# EAGLE design untitled (EAGLE 7.2.0)
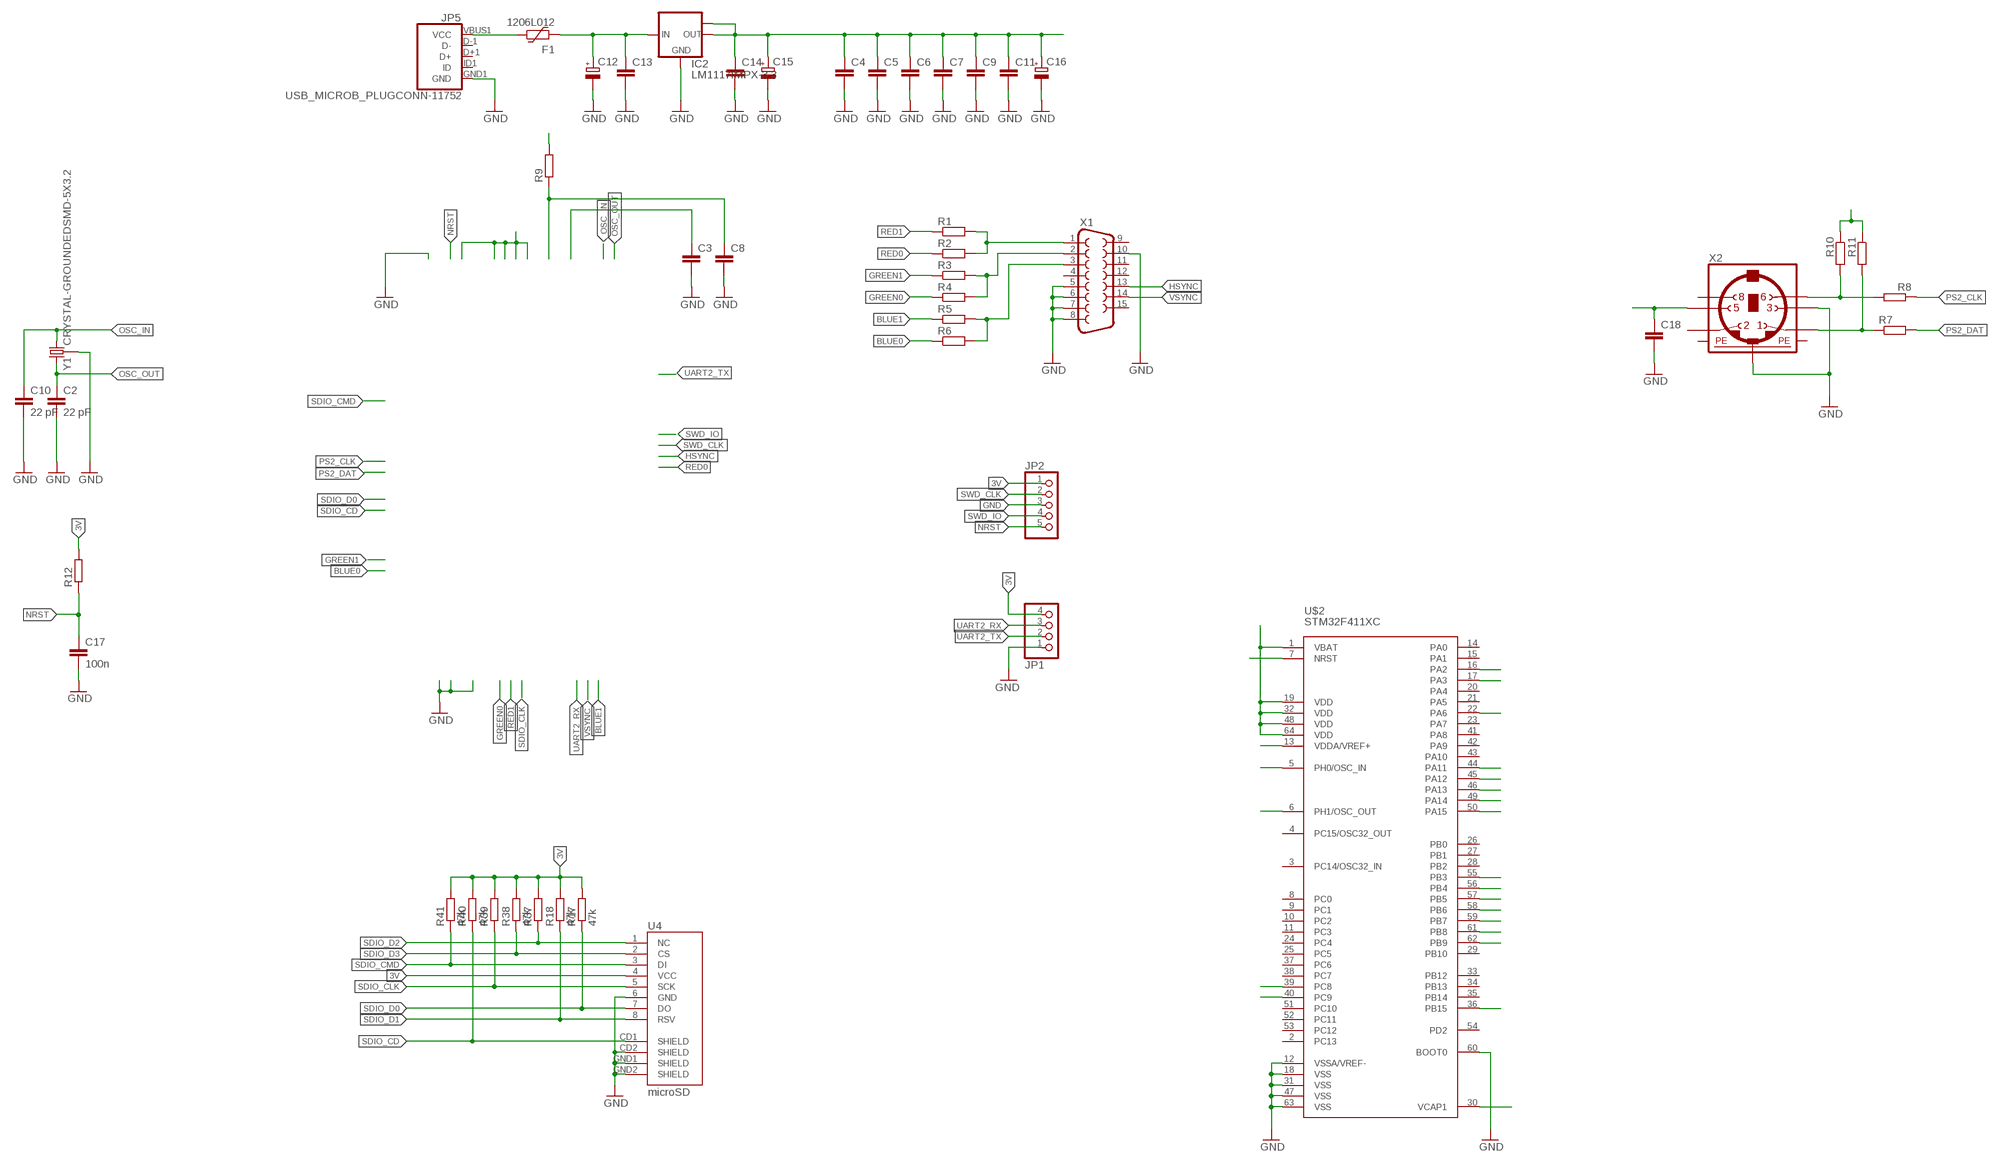
[diagram p0: schematic, sheet 1]

## Parts
C2  22 pF  C-EUC0603  [C0603]
C3  C-EUC0603  [C0603]
C4  C-EUC0603  [C0603]
C5  C-EUC0603  [C0603]
C6  C-EUC0603  [C0603]
C7  C-EUC0603  [C0603]
C8  C-EUC0603  [C0603]
C9  C-EUC0603  [C0603]
C10  22 pF  C-EUC0603  [C0603]
C11  C-EUC0603  [C0603]
C12  CPOL-EUSMCB  [SMC_B]
C13  C-EUC0603  [C0603]
C14  C-EUC0603  [C0603]
C15  CPOL-EUSMCB  [SMC_B]
C16  CPOL-EUSMCB  [SMC_B]
C17  100n  C-EUC0603  [C0603]
C18  C-EUC0603  [C0603]
F1  1206L012  [1206L]
IC2  LM1117IMPX-3.3  [SOT223]
JP1  PINHD-1X4  [1X04]
JP2  PINHD-1X5  [1X05]
JP5  USB_MICROB_PLUGCONN-11752  [USB-B-MICRO-SMD_V03]
R1  R-EU_R0603  [R0603]
R2  R-EU_R0603  [R0603]
R3  R-EU_R0603  [R0603]
R4  R-EU_R0603  [R0603]
R5  R-EU_R0603  [R0603]
R6  R-EU_R0603  [R0603]
R7  R-EU_R0603  [R0603]
R8  R-EU_R0603  [R0603]
R9  R-EU_M0805  [M0805]
R10  R-EU_R0603  [R0603]
R11  R-EU_R0603  [R0603]
R12  R-EU_R0603  [R0603]
R17  47k  R-EU_R0603  [R0603]
R18  47k  R-EU_R0603  [R0603]
R37  R-EU_R0402  [R0402]
R38  47k  R-EU_R0402  [R0402]
R39  R-EU_R0603  [R0603]
R40  47k  R-EU_R0603  [R0603]
R41  47k  R-EU_R0402  [R0402]
U4  microSD  USD-SOCKETUSD  [USD-SOCKET-PP]
U$2  STM32F411XC  [LQFP64]
X1  F15HDH  [HDF15H]
X2  MINI_DIN_6  [M_DIN6]
Y1  CRYSTAL-GROUNDEDSMD-5X3.2  [CRYSTAL-SMD-5X3.2-4PAD]

## Nets
3V: C4.1 C5.1 C6.1 C7.1 C9.1 C11.1 C14.1 C15.+ C16.+ IC2.2(OUT) IC2.TAB(OUT1) JP1.4 JP2.1 R9.2 R10.1 R11.1 R12.2 R17.2 R18.2 R37.2 R38.2 R39.2 R40.2 R41.2 U4.4(VCC) U$2.1(VBAT) U$2.19(VDD) U$2.32(VDD) U$2.48(VDD) U$2.64(VDD)
5V: C12.+ C13.1 C18.1 F1.2 IC2.3(IN) X2.5
BLUE0: R6.1 U$2.59(PB7)
BLUE1: R5.1 U$2.61(PB8)
GND: C2.2 C3.2 C4.2 C5.2 C6.2 C7.2 C8.2 C9.2 C10.2 C11.2 C12.- C13.2 C14.2 C15.- C16.- C17.2 C18.2 IC2.1(GND) JP1.1 JP2.3 JP5.GND1(GND) U4.6(GND) U4.CD2(SHIELD) U4.GND1(SHIELD) U4.GND2(SHIELD) U$2.12(VSSA/VREF-) U$2.18(VSS) U$2.31(VSS) U$2.47(VSS) U$2.60(BOOT0) U$2.63(VSS) X1.5 X1.6 X1.7 X1.8 X1.10 X2.3 X2.SH2(PE2) Y1.2 Y1.4
GREEN0: R4.1 U$2.57(PB5)
GREEN1: R3.1 U$2.58(PB6)
HSYNC: U$2.50(PA15) X1.13
N$1: R1.2 R2.2 X1.1
N$2: R3.2 R4.2 X1.2
N$3: R5.2 R6.2 X1.3
N$4: R7.1 R11.2 X2.1
N$5: R8.2 R10.2 X2.6
N$6: C8.1 R9.1 U$2.13(VDDA/VREF+)
N$8: C3.1 U$2.30(VCAP1)
N$17: F1.1 JP5.VBUS1(VCC)
NRST: C17.1 JP2.5 R12.1 U$2.7(NRST)
OSC_IN: C10.1 U$2.5(PH0/OSC_IN) Y1.1
OSC_OUT: C2.1 U$2.6(PH1/OSC_OUT) Y1.3
PS2_CLK: R8.1 U$2.44(PA11)
PS2_DAT: R7.2 U$2.45(PA12)
RED0: R2.1 U$2.55(PB3)
RED1: R1.1 U$2.56(PB4)
SDIO_CD: R40.1 U4.CD1(SHIELD) U$2.40(PC9)
SDIO_CLK: R39.1 U4.5(SCK) U$2.36(PB15)
SDIO_CMD: R41.1 U4.3(DI) U$2.22(PA6)
SDIO_D0: R17.1 U4.7(DO) U$2.39(PC8)
SDIO_D1: R18.1 U4.8(RSV)
SDIO_D2: R37.1 U4.1(NC)
SDIO_D3: R38.1 U4.2(CS)
SWD_CLK: JP2.2 U$2.49(PA14)
SWD_IO: JP2.4 U$2.46(PA13)
UART2_RX: JP1.3 U$2.17(PA3)
UART2_TX: JP1.2 U$2.16(PA2)
VSYNC: U$2.62(PB9) X1.14
Unconnected: JP5.D+1(D+) JP5.D-1(D-) JP5.ID1(ID) U$2.2(PC13) U$2.3(PC14/OSC32_IN) U$2.4(PC15/OSC32_OUT) U$2.8(PC0) U$2.9(PC1) U$2.10(PC2) U$2.11(PC3) U$2.14(PA0) U$2.15(PA1) U$2.20(PA4) U$2.21(PA5) U$2.23(PA7) U$2.24(PC4) U$2.25(PC5) U$2.26(PB0) U$2.27(PB1) U$2.28(PB2) U$2.29(PB10) U$2.33(PB12) U$2.34(PB13) U$2.35(PB14) U$2.37(PC6) U$2.38(PC7) U$2.41(PA8) U$2.42(PA9) U$2.43(PA10) U$2.51(PC10) U$2.52(PC11) U$2.53(PC12) U$2.54(PD2) X1.4 X1.9 X1.11 X1.12 X1.15 X2.2 X2.8

## Power pins joined to a net without a drawn wire
PE1: X2.SH1(PE1)
PE3: X2.SH3(PE3)

## Library data of the parts
C2-C11 C13 C14 C17 C18 = rcl:C-EU: CAPACITOR, European symbol
C12 C15 C16 = rcl:CPOL-EU: POLARIZED CAPACITOR, European symbol
F1 = polyfuse-smd_10:?: Polyfuse Resettable PTC Source: http://www.littelfuse.com/products/resettable-ptcs.aspx; MF: Littelfuse; MPN: 1206L012; OC_FARNELL: 1596988; OC_NEWARK: 05M2298
IC2 = lm1117:LM1117IMPX-*
JP1 = pinhead:PINHD-1X4: PIN HEADER
JP2 = pinhead:PINHD-1X5: PIN HEADER
JP5 = SparkFun-Connectors:USB_MICROB_PLUG: USB Micro-B connectors Some male, some female. Watch your step!; PROD_ID: CONN-11752
R1-R12 R17 R18 R37-R41 = rcl:R-EU_: RESISTOR, European symbol
U4 = SparkFun-Connectors:USD-SOCKET: microSD Socket Push-push type uSD socket. Schematic element and footprint production proven. Spark Fun Electronics SKU : PRT-00127. tDoc lines correctly indicate media card edge positions when inserting (unlocked, locked, depressed).
U$2 = stm32f411:STM32F411XC
X1 = adafruit:F15: SUB-D HDH is also known as a 'right angle VGA' connector
X2 = mini_din:MINI_DIN_6
Y1 = SparkFun-Clocks:CRYSTAL-GROUNDED: Crystals w/ Ground Pin (Generic) These are passive quartz crystals, which can be used as a clock source for a microcontroller. Crystal's are usually two-terminal devices. A third terminal may be optionally connected to ground, as recommended by the manufaturer.

## Board
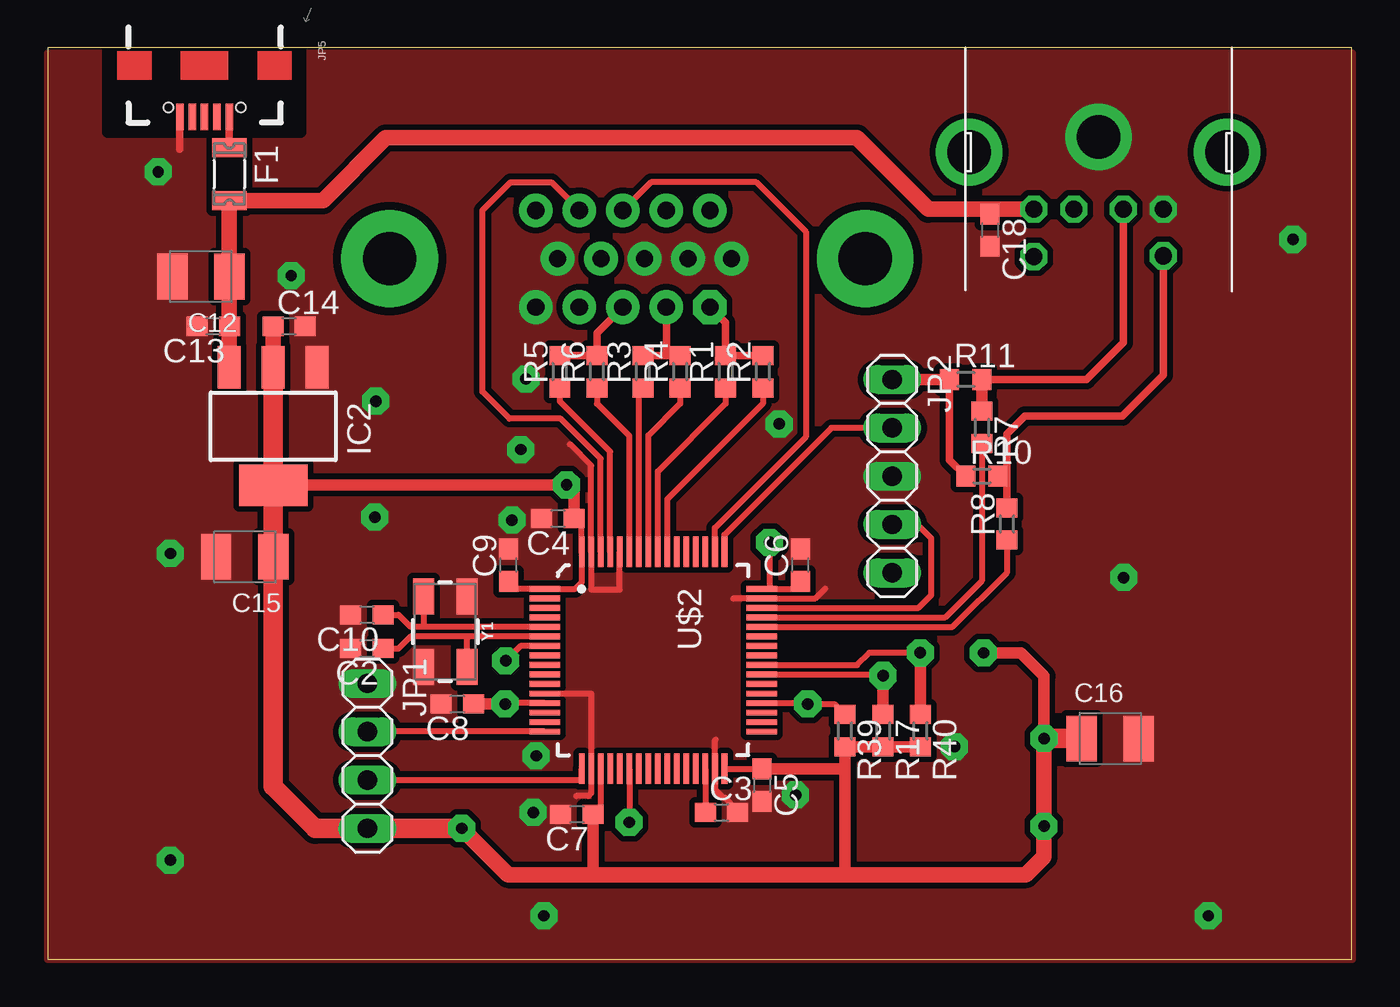
[diagram p1: board, top side]
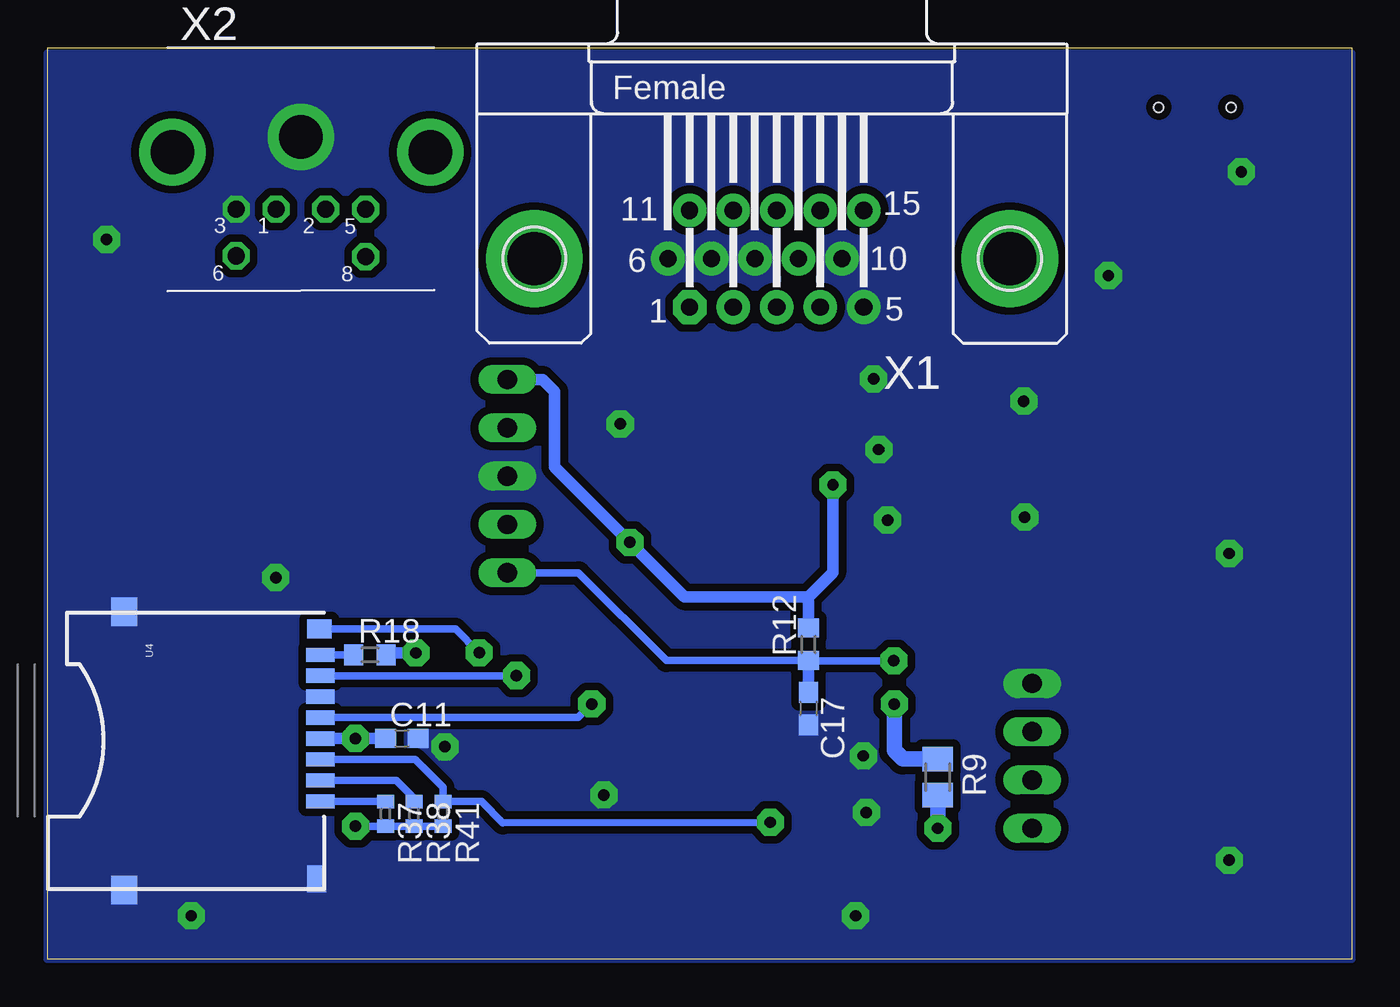
[diagram p2: board, bottom side, seen from below]

Size 68.56 x 47.93 mm. Coordinates in mm from the lower left corner, seen from the top.
Outline: 0,0 68.56,0 68.56,47.93 0,47.93 0,0
Copper layers (1*16): Top 0.035mm / dielectric 1.5mm / Bottom 0.035mm
Design rules "default *": minimum track width 10mil, minimum drill 24mil, track to track 8mil, track to pad 8mil, pad to pad 8mil, via to via 8mil, smd to smd 8mil, copper to edge 0mil, drill to drill 8mil, minimum pad ring 10mil, minimum via ring 8mil, stop-mask expansion 4mil, vias tented up to drill 0mil, thermal gap 10mil
tRestrict: area 3.1,43.5 to 13.3,47.9; area 8.7,40.3 to 10.5,42.2

### Footprints (pad centres in the part's own frame; a part is rotated, then mirrored left to right if it is on the bottom)
C0603 = smd 1.1 x 1: 1 -0.85,0; 2 0.85,0
SMC_B = smd 1.6 x 2.4: + -1.5,0; - 1.5,0
1206L = smd 1 x 1.8: 1 -1.4,0; 2 1.4,0
SOT223 = smd 1.219 x 2.235: 1 -2.311,-3.099; 2 0,-3.099; 3 2.311,-3.099 | smd 3.6 x 2.2: TAB 0,3.099
1X04 = drill 1.016 long: 1 -3.81,0; 2 -1.27,0; 3 1.27,0; 4 3.81,0
1X05 = drill 1.016 long: 1 -5.08,0; 2 -2.54,0; 3 0,0; 4 2.54,0; 5 5.08,0
USB-B-MICRO-SMD_V03 = smd 1.4 x 0.4: D+1 2.7,0; D-1 2.7,0.65; GND1 2.7,-1.3; ID1 2.7,-0.65; VBUS1 2.7,1.3 | hole 0.5: 2.2,1.9; 2.2,-1.9
R0603 = smd 1 x 1.1: 1 -0.85,0; 2 0.85,0
M0805 = smd 1.3 x 1.6: 1 -0.95,0; 2 0.95,0
R0402 = smd 0.7 x 0.9: 1 -0.65,0; 2 0.65,0
USD-SOCKET-PP = smd 0.75 x 1.5: 1 3.2,14.3; 2 2.1,14.3; 3 1,14.3; 4 -0.1,14.3; 5 -1.2,14.3; 6 -2.3,14.3; 7 -3.4,14.3; 8 -4.5,14.3 | smd 1 x 1.3: CD1 -5.85,14.25 | smd 1.4 x 1: CD2 7.275,14.1 | smd 1.5 x 1.35: GND1 -6.775,4; GND2 7.875,4
LQFP64 = smd 0.3 x 1.6: 1 -3.75,-5.7; 2 -3.25,-5.7; 3 -2.75,-5.7; 4 -2.25,-5.7; 5 -1.75,-5.7; 6 -1.25,-5.7; 7 -0.75,-5.7; 8 -0.25,-5.7; 9 0.25,-5.7; 10 0.75,-5.7; 11 1.25,-5.7; 12 1.75,-5.7; 13 2.25,-5.7; 14 2.75,-5.7; 15 3.25,-5.7; 16 3.75,-5.7; 33 3.75,5.7; 34 3.25,5.7; 35 2.75,5.7; 36 2.25,5.7; 37 1.75,5.7; 38 1.25,5.7; 39 0.75,5.7; 40 0.25,5.7; 41 -0.25,5.7; 42 -0.75,5.7; 43 -1.25,5.7; 44 -1.75,5.7; 45 -2.25,5.7; 46 -2.75,5.7; 47 -3.25,5.7; 48 -3.75,5.7 | smd 1.6 x 0.3: 17 5.7,-3.75; 18 5.7,-3.25; 19 5.7,-2.75; 20 5.7,-2.25; 21 5.7,-1.75; 22 5.7,-1.25; 23 5.7,-0.75; 24 5.7,-0.25; 25 5.7,0.25; 26 5.7,0.75; 27 5.7,1.25; 28 5.7,1.75; 29 5.7,2.25; 30 5.7,2.75; 31 5.7,3.25; 32 5.7,3.75; 49 -5.7,3.75; 50 -5.7,3.25; 51 -5.7,2.75; 52 -5.7,2.25; 53 -5.7,1.75; 54 -5.7,1.25; 55 -5.7,0.75; 56 -5.7,0.25; 57 -5.7,-0.25; 58 -5.7,-0.75; 59 -5.7,-1.25; 60 -5.7,-1.75; 61 -5.7,-2.25; 62 -5.7,-2.75; 63 -5.7,-3.25; 64 -5.7,-3.75
HDF15H = drill 0.9 pad 1.778 octagon: 1 4.329,2.54 | drill 0.9 pad 1.778: 2 2.043,2.54; 3 -0.243,2.54; 4 -2.529,2.54; 5 -4.815,2.54; 6 5.472,0; 7 3.186,0; 8 0.9,0; 9 -1.386,0; 10 -3.672,0; 11 4.329,-2.54; 12 2.043,-2.54; 13 -0.243,-2.54; 14 -2.529,-2.54; 15 -4.815,-2.54 | drill 2.8 pad 5.08: P$1 -12.5,0; P$2 12.5,0
M_DIN6 = drill 0.9 pad 1.422 octagon: 1 -1.3,-3.75; 2 1.3,-3.75; 3 -3.4,-3.75; 5 3.4,-3.75; 6 -3.4,-6.2; 8 3.4,-6.25 | drill 2.3 pad 3.5: SH1 6.8,-0.75; SH2 0,0.05; SH3 -6.75,-0.75
CRYSTAL-SMD-5X3.2-4PAD = smd 1.9 x 1.1: 1 -1.85,-1.15; 2 1.85,-1.15; 3 1.85,1.15; 4 -1.85,1.15

### Placement (x,y rotation side)
C2  16.79,16.34 180 top
C3  35.42,7.72 0 top
C4  26.82,23.16 180 top
C5  37.54,9.16 270 top
C6  39.57,20.72 90 top
C7  27.82,7.62 180 top
C8  21.54,13.42 180 top
C9  24.23,20.72 90 top
C10  16.79,18.11 180 top
C11  49.94,11.61 0 bottom
C12  8.05,35.89 180 top
C13  8.71,33.27 180 top
C14  12.7,33.27 0 top
C15  10.36,21.16 180 top
C16  55.85,11.61 0 top
C17  28.57,13.18 270 bottom
C18  49.53,38.33 270 top
F1  9.55,41.27 270 top
IC2  11.86,28.02 180 top
JP1  16.81,10.69 270 top
JP2  44.4,25.4 270 top
JP5  8.26,46.99 270 top
R1  35.64,30.89 90 top
R2  37.59,30.89 90 top
R3  31.29,30.89 90 top
R4  33.25,30.89 90 top
R5  26.92,30.89 90 top
R6  28.88,30.89 90 top
R7  49.11,27.97 270 top
R8  50.42,22.89 90 top
R9  21.77,9.58 270 bottom
R10  49.11,25.4 0 top
R11  48.26,30.48 0 top
R12  28.57,16.56 90 bottom
R17  43.92,12.01 270 top
R18  51.61,16.01 0 bottom
R37  50.8,7.65 270 bottom
R38  49.3,7.65 270 bottom
R39  41.91,12.01 270 top
R40  45.87,12.01 270 top
R41  47.78,7.65 270 bottom
U4  68.53,11.51 270 bottom
U$2  31.83,15.72 270 top
X1  30.48,36.83 180 bottom
X2  55.24,43.18 0 bottom
Y1  20.9,17.22 270 top

### Tracks (layer width: path | path; a pad name or v marks a point on that pad's centre or on a via)
3V  (via drill 0.6 pad 1.42)
  Top 0.305: 41.79,11.05 R39.2 | 28.08,21.36 U$2.64 | U$2.64 28.08,22.76 C4.1 | C9.1 24.63,19.47 U$2.1 27.73,19.47 28.08,19.82 U$2.64 | U$2.19 29.08,8.02 C7.1 | U$2.32 37.52,10.02 C5.1 | C6.1 39.17,19.47 U$2.48 37.95,19.47 v37.95,21.92
  Top 0.406: R11.1 47.41,26.25 R10.1
  Top 0.61: 11.86,33.26 C14.1 | JP2.1 R11.1 | v52.38,11.61 52.38,14.9 51.16,16.11 v49.2,16.11 | 41.91,9.98 R39.2 R17.2 R40.2 | 41.91,9.98 41.91,4.45 | C4.1 27.67,24.94 v27.28,24.94 11.89,24.94 IC2.TAB | C7.1 28.67,4.54 28.57,4.45 | 37.52,10.02 41.87,10.02 41.91,9.98
  Top 0.813: IC2.2 11.86,33.26 | v52.38,11.61 v52.38,7 52.38,5.38 51.44,4.45 41.91,4.45 28.57,4.45 24.21,4.45 v21.77,6.88
  Top 1.016: IC2.2 IC2.TAB C15.+ 11.86,9.09 14.07,6.88 JP1.4 v21.77,6.88 | v52.38,11.61 C16.+
  Bottom 0.406: R41.2 R38.2 R37.2 v52.38,7
  Bottom 0.61: 28.57,19.05 35.08,19.05 v37.95,21.92 41.91,25.88 41.91,29.84 42.55,30.48 JP2.1 | U4.4 v52.38,11.61 v52.37,11.61 C11.1 | R12.2 28.57,19.05 | v49.2,16.11 50.66,16.11 R18.2 | v27.28,24.94 27.28,20.34 28.57,19.05
  Bottom 0.813: v21.77,6.88 R9.2
5V
  Top 0.406: C13.1 | C12.+ 9.55,35.82 9.55,35.81 | C18.1 49.53,39.43
  Top 0.813: IC2.3 C13.1 9.55,35.81 F1.2 14.47,39.88 17.78,43.18 42.55,43.18 46.3,39.43 49.53,39.43 X2.5
BLUE0
  Top 0.305: R6.1 28.88,29.21 30.58,27.51 U$2.59
BLUE1
  Top 0.305: R5.1 26.92,29.34 29.58,26.68 U$2.61
GND  (via drill 0.6 pad 1.42)
  Top 0.305: U$2.12 28.58,13.97 U$2.18 28.58,8.74 28.42,8.59 27.79,8.59 | 27.46,27.08 28.58,25.96 U$2.63 28.58,19.43 30.08,19.43 U$2.60 | 35.89,8.2 35.59,8.51 35.51,8.51 35.08,8.94 U$2.31 35.08,11.51 35.13,11.56 | 36.04,18.95 36.07,18.97 U$2.47 40.36,18.97 40.87,19.48
  Top 0.406: JP5.GND1 6.96,42.59
  other vias: 39.32,8.64 25.53,7.72 24.41,23.09 38.46,28.14 25.15,30.51 12.8,35.94 17.25,29.34 6.45,21.34 5.82,41.4 47.68,11.18 56.57,20.07 6.45,5.21 65.46,37.85 61.01,2.29 17.2,23.24 26.09,2.29 25.68,10.69 24.87,26.8
  pour Top (isolate 0.305, no thermals): 0,47.62 0,0 68.58,0 68.58,47.62
  pour Bottom (isolate 0.406, no thermals): 0,47.62 0,0 68.58,0 68.58,47.62
GREEN0
  Top 0.305: R4.1 33.25,29.21 31.58,27.54 U$2.57
GREEN1
  Top 0.305: U$2.58 31.08,29.82 R3.1
HSYNC
  Top 0.305: X1.13 31.71,40.84 37.26,40.84 39.85,38.25 39.85,27.46 35.08,22.68 U$2.50
N$1
  Top 0.406: R2.2 R1.2 35.64,33.46 X1.1
N$2
  Top 0.406: 32.49,31.74 R4.2 32.89,31.74 | 32.49,31.74 R3.2 | X1.2 32.52,31.77 32.49,31.74
N$3
  Top 0.406: R5.2 R6.2 28.88,32.93 X1.3
N$4
  Top 0.406: R11.2 54.61,30.48 56.55,32.41 X2.1
  Top 0.61: R7.1 R11.2
N$5
  Top 0.406: R8.2 50.42,25.4 | 50.42,25.4 50.42,27.61 51.36,28.55 56.49,28.55 58.65,30.7 X2.6 | R10.2 50.42,25.4
N$6  (via drill 0.6 pad 1.42)
  Top 0.305: U$2.13 23.85,13.47 v24.05,13.42
  Top 0.61: v24.05,13.42 C8.1
  Bottom 0.813: R9.1 23.61,10.53 24.05,10.97 v24.05,13.42
N$8
  Top 0.305: U$2.30 C3.1
N$17
  Top 0.406: JP5.VBUS1 F1.1
NRST  (via drill 0.6 pad 1.42)
  Top 0.305: U$2.7 24.86,16.47 v24.08,15.7
  Bottom 0.406: JP2.5 40.64,20.32 36.03,15.71 R12.1 28.56,15.7 v24.08,15.7
  Bottom 0.61: C17.1 R12.1
OSC_IN
  Top 0.305: U$2.5 19.84,17.47 | 19.84,17.47 19.08,17.47 18.44,18.11 C10.1 | Y1.1 19.75,17.56 19.84,17.47
OSC_OUT
  Top 0.305: U$2.6 22.15,16.97 | 22.15,16.97 19.08,16.97 18.44,16.34 C2.1 | Y1.3 22.05,16.88 22.15,16.97
PS2_CLK
  Top 0.305: R8.1 50.42,20.32 47.57,17.47 U$2.44
PS2_DAT
  Top 0.305: R7.2 49.11,19.9 47.18,17.97 U$2.45
RED0
  Top 0.305: R2.1 37.59,29.21 32.58,24.19 U$2.55
RED1
  Top 0.305: R1.1 35.64,29.21 32.08,25.65 U$2.56
SDIO_CD  (via drill 0.6 pad 1.42)
  Top 0.305: v45.87,16.11 43.19,16.11 42.55,15.47 U$2.40
  Top 0.61: R40.1 v45.87,16.11
  Bottom 0.406: U4.CD1 47.12,17.36 v45.87,16.11
SDIO_CLK  (via drill 0.6 pad 1.42)
  Top 0.305: R39.1 41.35,13.42 v39.95,13.42 39.9,13.47 U$2.36
  Bottom 0.406: U4.5 40.67,12.71 v39.95,13.42
SDIO_CMD  (via drill 0.6 pad 1.42)
  Top 0.305: U$2.22 v30.58,7.2 v30.57,7.2
  Bottom 0.406: v30.57,7.2 44.64,7.17 45.76,8.29 R41.1 47.78,9.04 49.24,10.51 U4.3
SDIO_D0  (via drill 0.6 pad 1.42)
  Top 0.305: 43.9,14.92 v43.92,14.91 43.85,14.97 U$2.39
  Top 0.61: R17.1 v43.92,14.91
  Bottom 0.406: v43.92,14.91 U4.7
SDIO_D1
  Bottom 0.406: U4.8 R18.1
SDIO_D2
  Bottom 0.406: U4.1 R37.1
SDIO_D3
  Bottom 0.406: U4.2 50.25,9.41 49.3,8.46 R38.1
SWD_CLK
  Top 0.305: JP2.2 41.2,27.94 35.58,22.32 U$2.49
SWD_IO
  Top 0.305: JP2.4 45.72,22.86 46.46,22.12 46.46,19.15 45.78,18.47 U$2.46
UART2_RX
  Top 0.305: JP1.3 28.08,9.42 U$2.17
UART2_TX
  Top 0.305: U$2.16 16.82,11.97 JP1.2
VSYNC
  Top 0.305: X1.14 26.48,40.84 24.33,40.84 22.86,39.37 22.86,29.84 24.28,28.42 26.98,28.42 29.08,26.32 U$2.62